# Altium project DelSolClock_Rear.PrjPcb
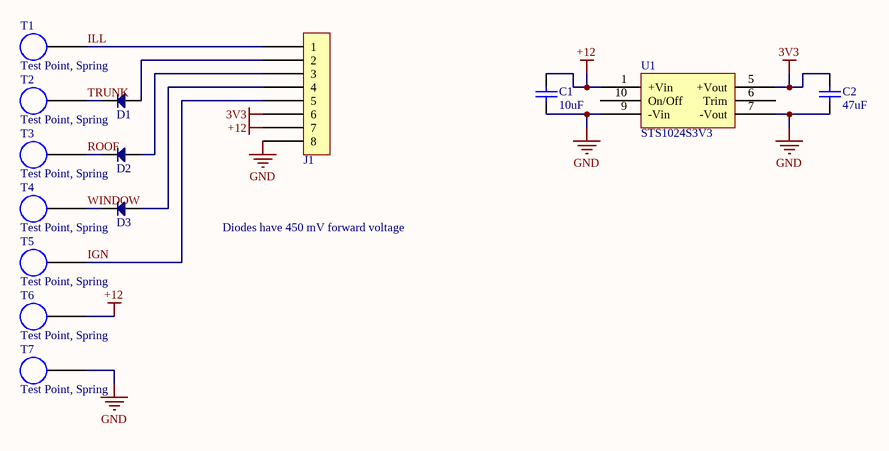
[diagram p0: DelSolClock_Rear.SchDoc]
1 sheet, 14 parts. Net scope: global (net labels, ports and power ports of the same name join across sheets).
Board file: DelSolClock_Rear.PcbDoc

## Sheet DelSolClock_Rear.SchDoc
size A

### Parts
C1  value 10uF  [6-0805]  (hidden comment: C2012X5R1E106K085AC)
C2  value 47uF  [6-0805]  (hidden comment: GRM21BR61A476ME15L)
D1  SD0805S020S1R0  [0805 HD - Polarized]  (value not drawn)
D2  SD0805S020S1R0  [0805 HD - Polarized]  (value not drawn)
D3  SD0805S020S1R0  [0805 HD - Polarized]  (value not drawn)
J1  68000-408HLF  [Conn, Header, 8x1 0.1 Pitch Unshrouded]  (value not drawn)
T1  Test Point, Spring  [Test Point, Spring]
T2  Test Point, Spring  [Test Point, Spring]
T3  Test Point, Spring  [Test Point, Spring]
T4  Test Point, Spring  [Test Point, Spring]
T5  Test Point, Spring  [Test Point, Spring]
T6  Test Point, Spring  [Test Point, Spring]
T7  Test Point, Spring  [Test Point, Spring]
U1  STS1024S3V3  [Module, STS1024S3V3]

### Nets
3V3: C2.2 J1.6 U1.5(+Vout)
+12: C1.2 J1.7 T6.1 U1.1(+Vin)
GND: C1.1 C2.1 J1.8 T7.1 U1.7(-Vout) U1.9(-Vin)
IGN: J1.5 T5.1
ILL: J1.1 T1.1
ROOF: D2.1(C) T3.1
TRUNK: D1.1(C) T2.1
WINDOW: D3.1(C) T4.1
NetD1_2: D1.2(A) J1.2
NetD2_2: D2.2(A) J1.3
NetD3_2: D3.2(A) J1.4

Not connected (* = marked no-connect by the designer): U1 6(Trim) 10(On/Off)

### Notes on the sheet
- Diodes have 450 mV forward voltage

### Library data of the parts
C1 C2 = Cap: Capacitor
  C1: MFGPN: C2012X5R1E106K085AC; Parameter 1: *; Parameter 2: *; Parameter 3: *
  C2: MFGPN: GRM21BR61A476ME15L
D1-D3 = Diode: DST: Digikey; MFG: Panasonic - ECG; DSTPN: *; ESTCOST: *; MFGPN: *
J1 = Conn, 68000-408HLF: Header, 8x1 0.1" Unshrouded Tin; DST: Digikey; DSTPN: 609-3264-ND; ESTCOST: .149; MFG: FCI; System: connector; MFGPN: 68000-408HLF
T1-T7 = Test Point, Spring: Test Point, for Del Sol Clock connection
U1 = Module, STS1024S3V3: Module, Regulator switching 3.3V 1A out 4.75-36v in SMT; MFG: XP Power; DSTPN: 1470-4724-ND; ESTCOST: 7.95; DST: Digikey; MFGPN: STS1024S3V3